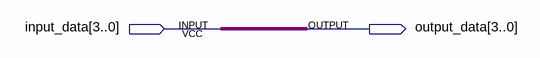
[diagram p0: schematic sheet]
// Quartus schematic slave_device.bdf as structural Verilog: 0 symbols, 2 pins
module slave_device (
  input  [3:0] input_data,
  output [3:0] output_data
);


  assign output_data = input_data;
endmodule
